# Altium schematic sheet Sheet1_Fontes_Chaveadas.SchDoc: Conversor Buck 24V 100W
size A3; Author: Artur de Araujo; DrawnBy: Artur de Araujo; Organization: UNIFOR - Universidade de Fortaleza; Address1: Av. Washington Soares, 1321; Address2: Edson Queiroz; Address3: CEP: 60811-905; Address4: Fortaleza - CE; DocumentNumber: 1; Revision: 0.2; SheetNumber: 1; SheetTotal: 1; Graduando:: Artur de Araujo; DocumentName: Conversor Buck 24V 100W
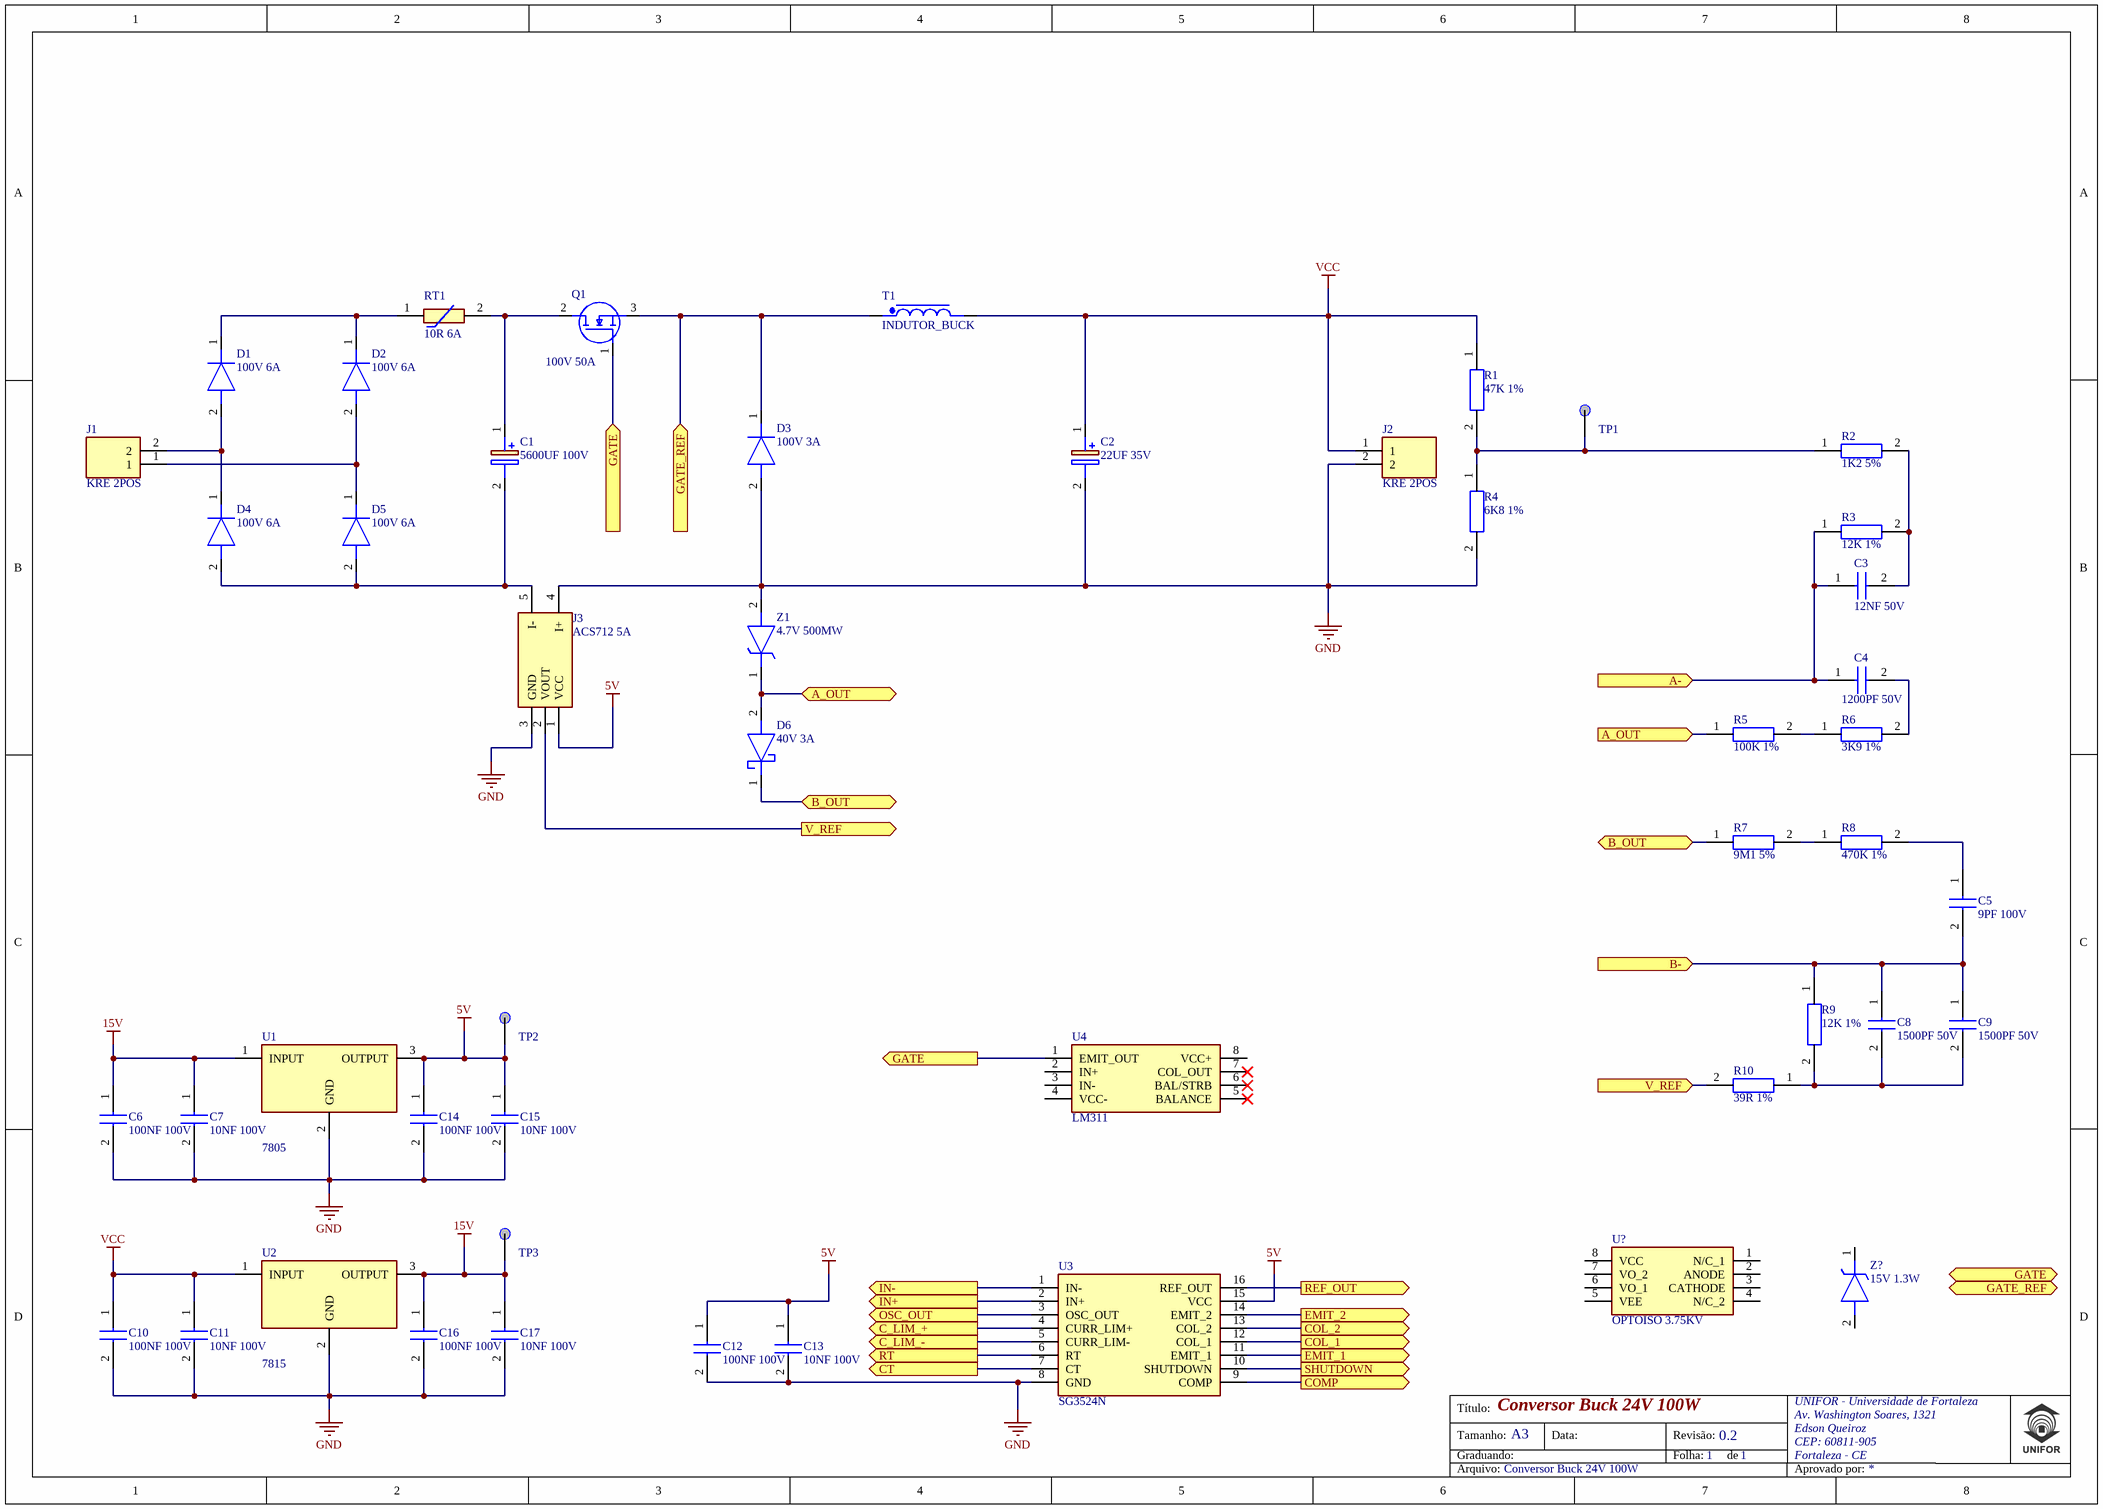
[diagram p0: Sheet1_Fontes_Chaveadas.SchDoc]

## Parts
C1  5600UF 100V  [CAP_RAD_D35MM_L10MM]
C2  22UF 35V  [CAP_RAD_D6MM3_L2MM5]
C3  12NF 50V  [CAP_RAD_4X2MM5]
C4  1200PF 50V  [CAP_RAD_4X2MM5]
C5  9PF 100V  [CAP_RAD_4X2MM5]
C6  100NF 100V  [CAP_RAD_4X2MM5]
C7  10NF 100V  [CAP_RAD_4X2MM5]
C8  1500PF 50V  [CAP_RAD_4X2MM5]
C9  1500PF 50V  [CAP_RAD_4X2MM5]
C10  100NF 100V  [CAP_RAD_4X2MM5]
C11  10NF 100V  [CAP_RAD_4X2MM5]
C12  100NF 100V  [CAP_RAD_4X2MM5]
C13  10NF 100V  [CAP_RAD_4X2MM5]
C14  100NF 100V  [CAP_RAD_4X2MM5]
C15  10NF 100V  [CAP_RAD_4X2MM5]
C16  100NF 100V  [CAP_RAD_4X2MM5]
C17  10NF 100V  [CAP_RAD_4X2MM5]
D1  100V 6A  [DIO_P600_AXIAL]
D2  100V 6A  [DIO_P600_AXIAL]
D3  100V 3A  [DIO_DO201AD]
D4  100V 6A  [DIO_P600_AXIAL]
D5  100V 6A  [DIO_P600_AXIAL]
D6  40V 3A  [DIO_DO201AD]
J1  KRE 2POS  [CONN_KF3012P]
J2  KRE 2POS  [CONN_KF3012P]
J3  ACS712 5A  [MODULE_ACS712]
Q1  100V 50A  [MOSFET_TO220AB]
R1  47K 1%  [RES_PTH_AXIAL_250MW]
R2  1K2 5%  [RES_PTH_AXIAL_250MW]
R3  12K 1%  [RES_PTH_AXIAL_250MW]
R4  6K8 1%  [RES_PTH_AXIAL_250MW]
R5  100K 1%  [RES_PTH_AXIAL_250MW]
R6  3K9 1%  [RES_PTH_AXIAL_250MW]
R7  9M1 5%  [RES_PTH_AXIAL_250MW]
R8  470K 1%  [RES_PTH_AXIAL_250MW]
R9  12K 1%  [RES_PTH_AXIAL_250MW]
R10  39R 1%  [RES_PTH_AXIAL_250MW]
RT1  10R 6A  [NTC_P7MM8_13MM]
T1  INDUTOR_BUCK  [TRF_1COIL]
TP1  TP  [TP_TRUE_HOLE_P102]  (value not drawn)
TP2  TP  [TP_TRUE_HOLE_P102]  (value not drawn)
TP3  TP  [TP_TRUE_HOLE_P102]  (value not drawn)
U1  7805  [IC_TO220AB]
U2  7815  [IC_TO220AB]
U3  SG3524N  [IC_16DIP]
U4  LM311  [IC_PTH_8DIP]
U?  OPTOISO 3.75KV  [IC_OPTO_8DIP]
Z1  4.7V 500MW  [DIO_DO35]
Z?  15V 1.3W  [DIO_1N4744A_DO204AL]

## Ports
A- (in), A_OUT (bidir), A_OUT (in), B- (in), B_OUT (bidir), C_LIM_+ (out), C_LIM_- (out), COL_1 (out), COL_2 (out), COMP (out), CT (out), EMIT_1 (out), EMIT_2 (out), GATE (in), GATE (out), GATE_REF (in), IN+ (out), IN- (out), OSC_OUT (out), REF_OUT (out), RT (out), SHUTDOWN (out), V_REF (in), V_REF (out)

## Nets
5V: C12.1 C13.1 C14.1 C15.1 J3.1(VCC) TP2.1 U1.3(OUTPUT) U3.15(VCC)
15V: C6.1 C7.1 C16.1 C17.1 TP3.1 U1.1(INPUT) U2.3(OUTPUT)
GND: C2.2(-) C6.2 C7.2 C10.2 C11.2 C12.2 C13.2 C14.2 C15.2 C16.2 C17.2 D3.2(A) J2.2 J3.3(GND) J3.4(I+) R4.2 U1.2(GND) U2.2(GND) U3.8(GND) Z1.2(A)
VCC: C2.1(+) C10.1 C11.1 J2.1 R1.1 T1.2(Pri-) U2.1(INPUT)
A-: C3.1 C4.1 R3.1 ; port A-
A_OUT: D6.2(A) R5.1 Z1.1(K) ; port A_OUT
B-: C5.2 C8.1 C9.1 R9.1 ; port B-
B_OUT: D6.1(K) R7.1 ; port B_OUT
C_LIM_+: U3.4(CURR_LIM+) ; port C_LIM_+
C_LIM_-: U3.5(CURR_LIM-) ; port C_LIM_-
COL_1: U3.12(COL_1) ; port COL_1
COL_2: U3.13(COL_2) ; port COL_2
COMP: U3.9(COMP) ; port COMP
CT: U3.7(CT) ; port CT
EMIT_1: U3.11(EMIT_1) ; port EMIT_1
EMIT_2: U3.14(EMIT_2) ; port EMIT_2
GATE: Q1.1(G) U4.1(EMIT_OUT) ; port GATE
GATE_REF: D3.1(K) Q1.3(S) T1.1(Pri+) ; port GATE_REF
IN+: U3.2(IN+) ; port IN+
IN-: U3.1(IN-) ; port IN-
OSC_OUT: U3.3(OSC_OUT) ; port OSC_OUT
REF_OUT: U3.16(REF_OUT) ; port REF_OUT
RT: U3.6(RT) ; port RT
SHUTDOWN: U3.10(SHUTDOWN) ; port SHUTDOWN
V_REF: J3.2(VOUT) R10.2 ; port V_REF
NetC1_1: C1.1(+) Q1.2(D) RT1.2
NetC1_2: C1.2(-) D4.2(A) D5.2(A) J3.5(I-)
NetC3_2: C3.2 R2.2 R3.2
NetC4_2: C4.2 R6.2
NetC5_1: C5.1 R8.2
NetC8_2: C8.2 C9.2 R9.2 R10.1
NetD1_1: D1.1(K) D2.1(K) RT1.1
NetD1_2: D1.2(A) D4.1(K) J1.2
NetD2_2: D2.2(A) D5.1(K) J1.1
NetR1_2: R1.2 R2.1 R4.1 TP1.1
NetR5_2: R5.2 R6.1
NetR7_2: R7.2 R8.1

Not connected (* = marked no-connect by the designer): U4 2(IN+) 3(IN-) 4(VCC-) 5(BALANCE)* 6(BAL/STRB)* 7(COL_OUT)* 8(VCC+); U? 1(N/C_1) 2(ANODE) 3(CATHODE) 4(N/C_2) 5(VEE) 6(VO_1) 7(VO_2) 8(VCC); Z? 1(K) 2(A)

## Notes on the sheet
- Título:
- Tamanho:
- Graduando:
- A3
- Data:
- Revisão:
- Folha:
- de
- Arquivo:
- Aprovado por:

## Library data of the parts
C1 = CAP_ALUM_5600UF_100V_RAD: CAP ALUM 5600UF 20% 100V SNAP; PartNumber: MAL225659562E3
C2 = CAP_ALUM_22UF_35V_RAD: CAP ALUM POLY 22UF 20% 35V T/H; PartNumber: 870055673002
C3 = CAP_CER_12NF_50V_RAD: CAP CER 0.012UF 50V C0G/NP0 RAD; PartNumber: RCE5C1H123J1DBH03A
C4 = CAP_CER_1200PF_50V_RAD: CAP CER 1200PF 50V C0G RADIAL; PartNumber: FA18C0G1H122JNU06
C5 = CAP_CER_9PF_100V_RAD: CAP CER 9PF 100V C0G RADIAL; PartNumber: FG18C0G2A090DNT06
C6 C10 C12 C14 C16 = CAP_CER_100NF_100V_RAD: CAP CER 0.1UF 100V X7S RADIAL; PartNumber: FG18X7S2A104KRT06
C7 C11 C13 C15 C17 = CAP_CER_10NF_100V_RAD: CAP CER 10NF 100V C0G/NP0 RADIAL; PartNumber: FA18C0G2A103JRU06
C8 C9 = CAP_CER_1500PF_50V_RAD: CAP CER 1500PF 50V C0G RADIAL; PartNumber: FG18C0G1H152JNT06
D1 D2 D4 D5 = DIO_PTH_STD_100V_6A_P600B: DIODE GEN PURP 100V 6A P600; PartNumber: P600B-E3/54
D3 = DIO_PTH_STD_100V_3A_DO201AD: DIODE GEN PURP 100V 3A DO201AD; PartNumber: UF5401-E3/54
D6 = DIO_PTH_SCHOTTKY_SB340: DIODE SCHOTTKY 40V 3A DO201AD; PartNumber: SB340-E3/54
J1 J2 = CONN_2POS: TERM BLK 2POS SIDE ENTRY 5MM PCB; PartNumber: 1776244-2
J3 = MODULE_SENSOR_ACS712: Módulo Sensor de Corrente ACS712 5A; PartNumber: _MODULE_ACS712
Q1 = MOSFET_SUP70090E: MOSFET N-CH 100V 50A TO220AB; PartNumber: SUP70090E-GE3
R1 = RES_47K_1%_250MW_AXIAL: RES 47K OHM 1% 1/4W AXIAL; PartNumber: MFR-25FTE52-47K
R2 = RES_1K2_5%_250MW_AXIAL: RES 1.2K OHM 5% 1/4W AXIAL; PartNumber: CFR-25JB-52-1K2
R3 R9 = RES_12K_1%_250MW_AXIAL: RES 12K OHM 1% 1/4W AXIAL; PartNumber: MFR-25FTE52-12K
R4 = RES_6K8_1%_250MW_AXIAL: RES 6.8K OHM 1% 1/4W AXIAL; PartNumber: MFR-25FTE52-6K8
R5 = RES_100K_1%_250MW_AXIAL: RES 100K OHM 1% 1/4W AXIAL; PartNumber: FMF-25FTF52-100K
R6 = RES_3K9_1%_600MW_AXIAL: RES 3.9K OHM 1% 0.6W AXIAL; PartNumber: MF0207FTE52-3K9
R7 = RES_9M1_5%_250MW_AXIAL: RES 9.1M OHM 5% 1/4W AXIAL; PartNumber: CFR-25JB-52-9M1
R8 = RES_470K_1%_250MW_AXIAL: RES 470K OHM 1% 1/4W AXIAL; PartNumber: MFR-25FRF52-470K
R10 = RES_39R_1%_250MW_AXIAL: RES 39 OHM 1% 1/4W AXIAL; PartNumber: MFR-25FTE52-39R
RT1 = NTC_10R_6A: ICL 10 OHM 20% 6A 13MM
T1 = INDUTOR_BUCK: Transformer (Equivalent Circuit Model); PartNumber: _TRAFO_01
TP1-TP3 = TP_PTH_40MIL: PC TEST POINT MINIATURE BLACK; PartNumber: _TP_PTH_40MIL
U1 = IC_LM7805: IC REG LINEAR 5V 1.5A TO220AB
U2 = IC_LM7815: IC REG LINEAR 15V 1.5A TO220AB
U3 = IC_SG3524NG4: IC REG CTRLR MULT TOPOLOGY 16DIP; PartNumber: SG3524N
U4 = IC_OPAMP_LM311: IC DIFF COMP W/STROBE 8DIP
U? = OPTO_HCPL3120000E: OPTOISO 3.75KV 1CH GATE DVR 8DIP
Z1 = DIO_PTH_ZENER_4V7_500MW_DO35: DIODE ZENER 4.7V 500MW DO35; PartNumber: 1N5230B
Z? = DIO_PTH_ZENER_15V_1W3_1N4744A: DIODE ZENER 15V 1.3W DO41